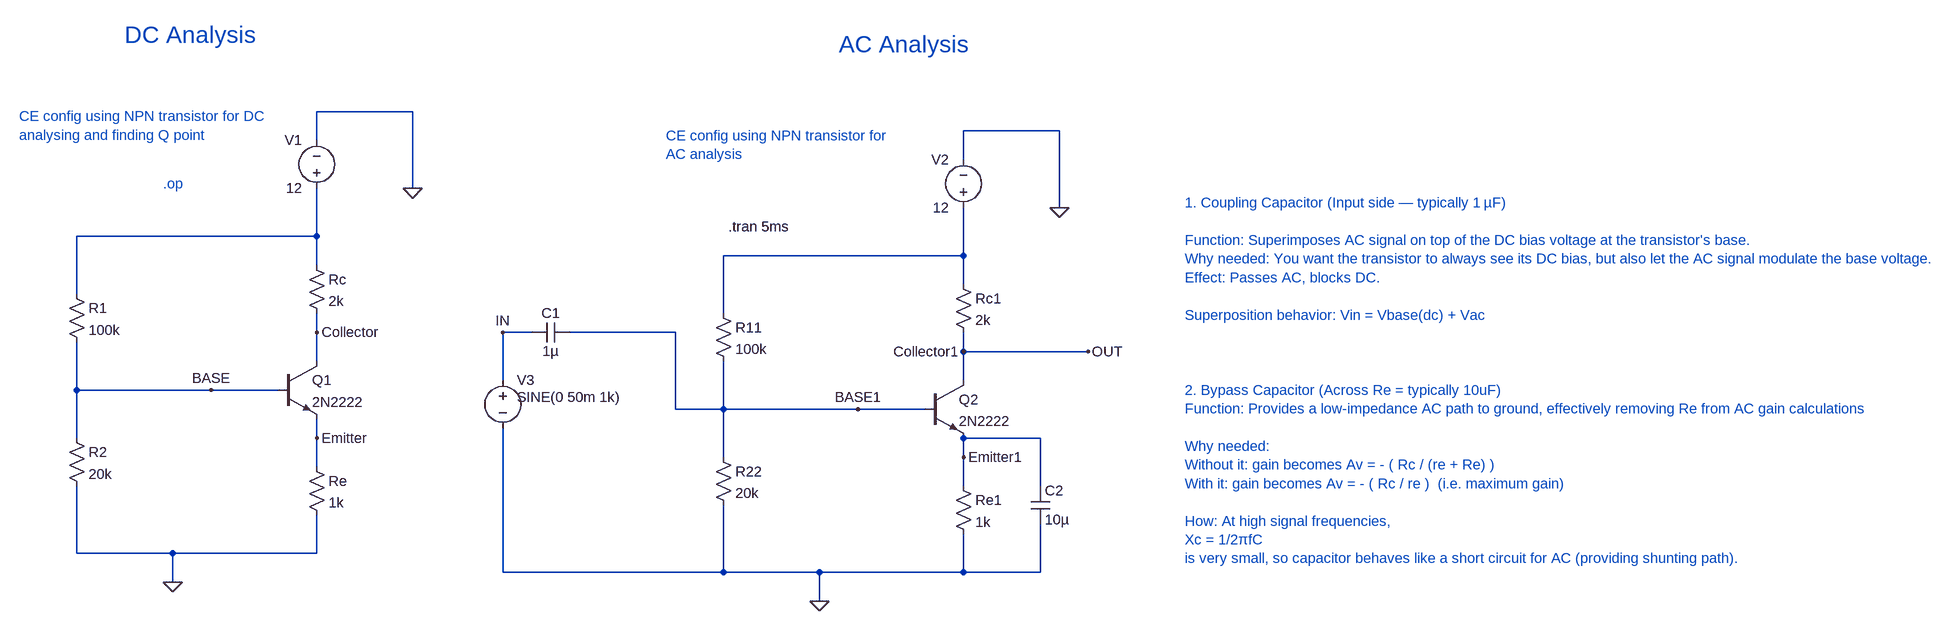
[diagram p0: schematic CE_config_AC_bias.asc]
CE_config_AC_bias.asc, the LTspice schematic file:
Version 4.1
SHEET 1 2976 724
WIRE -320 -368 -480 -368
WIRE 1360 -336 1200 -336
WIRE -480 -320 -480 -368
WIRE 1200 -288 1200 -336
WIRE -320 -240 -320 -368
WIRE 1360 -208 1360 -336
WIRE -480 -160 -480 -240
WIRE -480 -160 -880 -160
WIRE 1200 -128 1200 -208
WIRE 1200 -128 800 -128
WIRE -480 -112 -480 -160
WIRE 1200 -80 1200 -128
WIRE -880 -64 -880 -160
WIRE 800 -32 800 -128
WIRE -480 0 -480 -32
WIRE 480 0 432 0
WIRE 720 0 544 0
WIRE 1200 32 1200 0
WIRE 1408 32 1200 32
WIRE -480 48 -480 0
WIRE 432 80 432 0
WIRE 1200 80 1200 32
WIRE -880 96 -880 16
WIRE -656 96 -880 96
WIRE -544 96 -656 96
WIRE 720 128 720 0
WIRE 800 128 800 48
WIRE 800 128 720 128
WIRE 1024 128 800 128
WIRE 1136 128 1024 128
WIRE -880 176 -880 96
WIRE -480 176 -480 144
WIRE 1328 176 1200 176
WIRE 800 208 800 128
WIRE 1200 208 1200 176
WIRE -480 224 -480 176
WIRE 1200 256 1200 208
WIRE 1328 256 1328 176
WIRE -880 368 -880 256
WIRE -720 368 -880 368
WIRE -480 368 -480 304
WIRE -480 368 -720 368
WIRE 432 400 432 160
WIRE 800 400 800 288
WIRE 800 400 432 400
WIRE 960 400 800 400
WIRE 1200 400 1200 336
WIRE 1200 400 960 400
WIRE 1328 400 1328 320
WIRE 1328 400 1200 400
WIRE -720 416 -720 368
WIRE 960 448 960 400
FLAG -320 -240 0
FLAG -720 416 0
FLAG -480 0 Collector
FLAG -480 176 Emitter
FLAG -656 96 BASE
FLAG 1360 -208 0
FLAG 960 448 0
FLAG 1200 32 Collector1
FLAG 1200 208 Emitter1
FLAG 1024 128 BASE1
FLAG 432 0 IN
FLAG 1408 32 OUT
SYMBOL npn -544 48 R0
SYMATTR InstName Q1
SYMATTR Value 2N2222
SYMBOL voltage -480 -224 R180
WINDOW 0 24 96 Left 2
WINDOW 3 24 16 Left 2
WINDOW 123 0 0 Left 0
WINDOW 39 0 0 Left 0
SYMATTR InstName V1
SYMATTR Value 12
SYMBOL res -496 -128 R0
SYMATTR InstName Rc
SYMATTR Value 2k
SYMBOL res -496 208 R0
SYMATTR InstName Re
SYMATTR Value 1k
SYMBOL res -896 -80 R0
SYMATTR InstName R1
SYMATTR Value 100k
SYMBOL res -896 160 R0
SYMATTR InstName R2
SYMATTR Value 20k
SYMBOL npn 1136 80 R0
SYMATTR InstName Q2
SYMATTR Value 2N2222
SYMBOL voltage 1200 -192 R180
WINDOW 0 24 96 Left 2
WINDOW 3 24 16 Left 2
WINDOW 123 0 0 Left 0
WINDOW 39 0 0 Left 0
SYMATTR InstName V2
SYMATTR Value 12
SYMBOL res 1184 -96 R0
SYMATTR InstName Rc1
SYMATTR Value 2k
SYMBOL res 1184 240 R0
SYMATTR InstName Re1
SYMATTR Value 1k
SYMBOL res 784 -48 R0
SYMATTR InstName R11
SYMATTR Value 100k
SYMBOL res 784 192 R0
SYMATTR InstName R22
SYMATTR Value 20k
SYMBOL voltage 432 64 R0
WINDOW 3 24 44 Left 2
WINDOW 123 0 0 Left 0
WINDOW 39 0 0 Left 0
SYMATTR Value SINE(0 50m 1k)
SYMATTR InstName V3
SYMBOL cap 544 -16 R90
WINDOW 0 0 32 VBottom 2
WINDOW 3 32 32 VTop 2
SYMATTR InstName C1
SYMATTR Value 1µ
SYMBOL cap 1312 256 R0
SYMATTR InstName C2
SYMATTR Value 10µ
TEXT -736 -248 Left 2 ;.op
TEXT -976 -360 Left 2 ;CE config using NPN transistor for DC \nanalysing and finding Q point
TEXT 704 -328 Left 2 ;CE config using NPN transistor for \nAC analysis
TEXT 808 -176 Left 2 !.tran 5ms
TEXT 1624 -216 Left 2 ;1. Coupling Capacitor (Input side — typically 1 µF)\n \nFunction: Superimposes AC signal on top of the DC bias voltage at the transistor's base.\nWhy needed: You want the transistor to always see its DC bias, but also let the AC signal modulate the base voltage.\nEffect: Passes AC, blocks DC.\n \nSuperposition behavior: Vin = Vbase(dc) + Vac
TEXT 1624 96 Left 2 ;2. Bypass Capacitor (Across Re = typically 10uF)\nFunction: Provides a low-impedance AC path to ground, effectively removing Re from AC gain calculations\n \nWhy needed: \nWithout it: gain becomes Av = - ( Rc / (re + Re) )\nWith it: gain becomes Av = - ( Rc / re )  (i.e. maximum gain)\n \nHow: At high signal frequencies,\nXc = 1/2πfC \nis very small, so capacitor behaves like a short circuit for AC (providing shunting path).
TEXT -800 -496 Left 4 ;DC Analysis
TEXT 992 -480 Left 4 ;AC Analysis

The netlist it stands for:
* CE_config_AC_bias.asc
Q1 Collector BASE Emitter 0 2N2222
V1 N001 0 12
Rc N001 Collector 2k
Re Emitter 0 1k
R1 N001 BASE 100k
R2 BASE 0 20k
Q2 OUT BASE1 Emitter1 0 2N2222
V2 N002 0 12
Rc1 N002 OUT 2k
Re1 Emitter1 0 1k
R11 N002 BASE1 100k
R22 BASE1 0 20k
V3 IN 0 SINE(0 50m 1k)
C1 BASE1 IN 1µ
C2 Emitter1 0 10µ
.model NPN NPN
.model PNP PNP
.lib standard.bjt
* .op
* CE config using NPN transistor for DC
* analysing and finding Q point
* CE config using NPN transistor for
* AC analysis
.tran 5ms
* 1. Coupling Capacitor (Input side — typically 1 µF)
* Function: Superimposes AC signal on top of the DC bias voltage at the transistor's base.
* Why needed: You want the transistor to always see its DC bias, but also let the AC signal modulate the base voltage.
* Effect: Passes AC, blocks DC.
* Superposition behavior: Vin = Vbase(dc) + Vac
* 2. Bypass Capacitor (Across Re = typically 10uF)
* Function: Provides a low-impedance AC path to ground, effectively removing Re from AC gain calculations
* Why needed:
* Without it: gain becomes Av = - ( Rc / (re + Re) )
* With it: gain becomes Av = - ( Rc / re )  (i.e. maximum gain)
* How: At high signal frequencies,
* Xc = 1/2πfC
* is very small, so capacitor behaves like a short circuit for AC (providing shunting path).
* DC Analysis
* AC Analysis
.backanno
.end